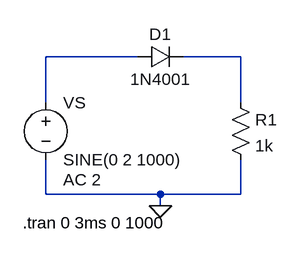
[diagram p0: schematic Draft9.asc]
Draft9.asc, the LTspice schematic file:
Version 4
SHEET 1 880 680
WIRE 112 96 -16 96
WIRE 256 96 176 96
WIRE -16 160 -16 96
WIRE 256 160 256 96
WIRE -16 288 -16 240
WIRE 144 288 -16 288
WIRE 256 288 256 240
WIRE 256 288 144 288
WIRE 144 304 144 288
FLAG 144 304 0
SYMBOL res 240 144 R0
SYMATTR InstName R1
SYMATTR Value 1k
SYMBOL diode 112 112 R270
WINDOW 0 32 32 VTop 2
WINDOW 3 0 32 VBottom 2
SYMATTR InstName D1
SYMATTR Value 1N4001
SYMBOL voltage -16 144 R0
WINDOW 123 24 124 Left 2
WINDOW 39 0 0 Left 0
SYMATTR Value2 AC 2
SYMATTR InstName VS
SYMATTR Value SINE(0 2 1000)
TEXT -48 328 Left 2 !.tran 0 3ms 0 1000

The netlist it stands for:
* Draft9.asc
R1 N002 0 1k
D1 N001 N002 1N4001
VS N001 0 SINE(0 2 1000) AC 2
.model D D
.lib standard.dio
.tran 0 3ms 0 1000
.backanno
.end